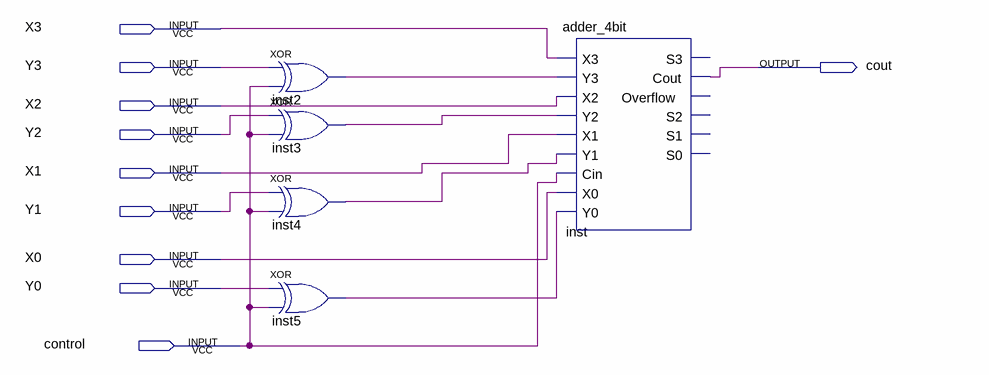
[diagram p0: schematic sheet]
// Quartus schematic comparator.bdf as structural Verilog: 5 symbols, 10 pins
module comparator (
  input  X3,
  input  Y3,
  input  X2,
  input  Y2,
  input  X1,
  input  Y1,
  input  X0,
  input  Y0,
  input  control,
  output cout
);

  wire inst2_out, inst3_out, inst4_out, inst5_out;

  xor inst2 (inst2_out, Y3, control);
  xor inst3 (inst3_out, Y2, control);
  xor inst4 (inst4_out, Y1, control);
  xor inst5 (inst5_out, Y0, control);
  adder_4bit inst (
    .X3(X3), .Y3(inst2_out), .X2(X2), .Y2(inst3_out), .X1(X1), .Y1(inst4_out), .Cin(control), .X0(X0),
    .Y0(inst5_out), .Cout(cout));  // open: S3, Overflow, S2, S1, S0
endmodule
